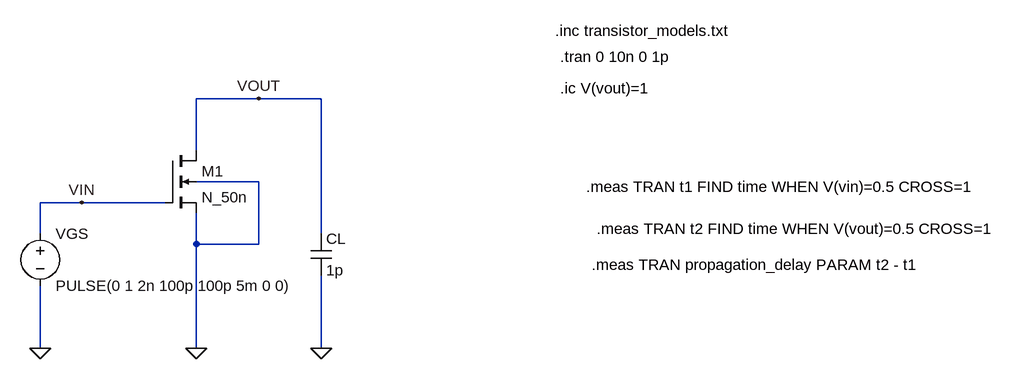
[diagram p0: schematic lab01_nmos_rc.asc]
lab01_nmos_rc.asc, the LTspice schematic file:
Version 4
SHEET 1 1552 680
WIRE 384 -112 288 -112
WIRE 480 -112 384 -112
WIRE 288 -32 288 -112
WIRE 384 16 288 16
WIRE 112 48 48 48
WIRE 240 48 112 48
WIRE 48 96 48 48
WIRE 480 96 480 -112
WIRE 288 112 288 64
WIRE 384 112 384 16
WIRE 384 112 288 112
WIRE 48 272 48 176
WIRE 288 272 288 112
WIRE 480 272 480 160
FLAG 480 272 0
FLAG 288 272 0
FLAG 48 272 0
FLAG 384 -112 VOUT
FLAG 112 48 VIN
SYMBOL voltage 48 80 R0
WINDOW 123 0 0 Left 0
WINDOW 39 0 0 Left 0
SYMATTR InstName VGS
SYMATTR Value PULSE(0 1 2n 100p 100p 5m 0 0)
SYMBOL nmos4 240 -32 R0
SYMATTR InstName M1
SYMATTR Value N_50n
SYMATTR Value2 l=50n w=1000n
SYMBOL cap 464 96 R0
SYMATTR InstName CL
SYMATTR Value 1p
TEXT 840 -216 Left 2 !.inc transistor_models.txt
TEXT 848 -176 Left 2 !.tran 0 10n 0 1p
TEXT 848 -128 Left 2 !.ic V(vout)=1
TEXT 888 24 Left 2 !.meas TRAN t1 FIND time WHEN V(vin)=0.5 CROSS=1
TEXT 904 88 Left 2 !.meas TRAN t2 FIND time WHEN V(vout)=0.5 CROSS=1
TEXT 896 144 Left 2 !.meas TRAN propagation_delay PARAM t2 - t1

The netlist it stands for:
* lab01_nmos_rc.asc
VGS VIN 0 PULSE(0 1 2n 100p 100p 5m 0 0)
M1 VOUT VIN 0 0 N_50n l=50n w=1000n
CL VOUT 0 1p
.model NMOS NMOS
.model PMOS PMOS
.lib standard.mos
.inc transistor_models.txt
.tran 0 10n 0 1p
.ic V(vout)=1
.meas TRAN t1 FIND time WHEN V(vin)=0.5 CROSS=1
.meas TRAN t2 FIND time WHEN V(vout)=0.5 CROSS=1
.meas TRAN propagation_delay PARAM t2 - t1
.backanno
.end